# Altium schematic sheet S3_LED_MAT_FPGA_POWER.SchDoc: FPGA Power
size A3; Date: "Day, Month  DD, YYYY"; DrawnBy: KSN; Engineer: Dim Su; Revision: 2.0; SheetNumber: 4; SheetTotal: 7; ContentRev1: Original Document; dateREV1: "Aug/08/2018"; dateREV2: "Sep/03/2018"; ContentRev2: Changes to the power pins; Rev1: V1; Rev2: V2; Project: LED_MAT_3
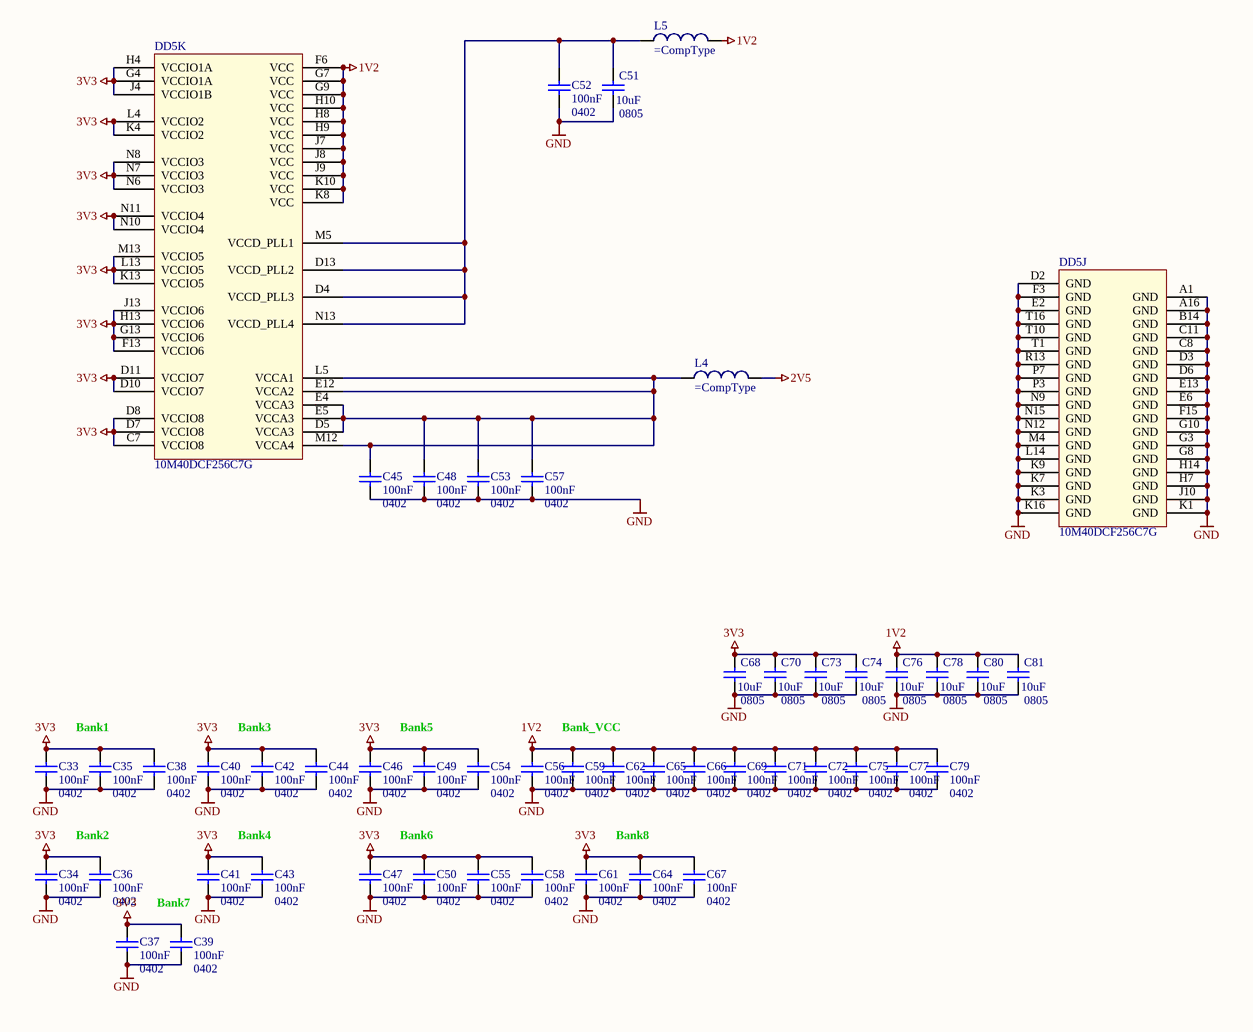
[diagram p0: S3_LED_MAT_FPGA_POWER.SchDoc]

## Parts
C33  value 100nF  Package: 0402  [CAPC1005L]  (hidden comment: 100nF / 0402 / X7R / 16V)
C34  value 100nF  Package: 0402  [CAPC1005L]  (hidden comment: 100nF / 0402 / X7R / 16V)
C35  value 100nF  Package: 0402  [CAPC1005L]  (hidden comment: 100nF / 0402 / X7R / 16V)
C36  value 100nF  Package: 0402  [CAPC1005L]  (hidden comment: 100nF / 0402 / X7R / 16V)
C37  value 100nF  Package: 0402  [CAPC1005L]  (hidden comment: 100nF / 0402 / X7R / 16V)
C38  value 100nF  Package: 0402  [CAPC1005L]  (hidden comment: 100nF / 0402 / X7R / 16V)
C39  value 100nF  Package: 0402  [CAPC1005L]  (hidden comment: 100nF / 0402 / X7R / 16V)
C40  value 100nF  Package: 0402  [CAPC1005L]  (hidden comment: 100nF / 0402 / X7R / 16V)
C41  value 100nF  Package: 0402  [CAPC1005L]  (hidden comment: 100nF / 0402 / X7R / 16V)
C42  value 100nF  Package: 0402  [CAPC1005L]  (hidden comment: 100nF / 0402 / X7R / 16V)
C43  value 100nF  Package: 0402  [CAPC1005L]  (hidden comment: 100nF / 0402 / X7R / 16V)
C44  value 100nF  Package: 0402  [CAPC1005L]  (hidden comment: 100nF / 0402 / X7R / 16V)
C45  value 100nF  Package: 0402  [CAPC1005L]  (hidden comment: 100nF / 0402 / X7R / 16V)
C46  value 100nF  Package: 0402  [CAPC1005L]  (hidden comment: 100nF / 0402 / X7R / 16V)
C47  value 100nF  Package: 0402  [CAPC1005L]  (hidden comment: 100nF / 0402 / X7R / 16V)
C48  value 100nF  Package: 0402  [CAPC1005L]  (hidden comment: 100nF / 0402 / X7R / 16V)
C49  value 100nF  Package: 0402  [CAPC1005L]  (hidden comment: 100nF / 0402 / X7R / 16V)
C50  value 100nF  Package: 0402  [CAPC1005L]  (hidden comment: 100nF / 0402 / X7R / 16V)
C51  value 10uF  Package: 0805  [CAPC2012L]  (hidden comment: 10uF / 0805 /  X5R / 10V)
C52  value 100nF  Package: 0402  [CAPC1005L]  (hidden comment: 100nF / 0402 / X7R / 16V)
C53  value 100nF  Package: 0402  [CAPC1005L]  (hidden comment: 100nF / 0402 / X7R / 16V)
C54  value 100nF  Package: 0402  [CAPC1005L]  (hidden comment: 100nF / 0402 / X7R / 16V)
C55  value 100nF  Package: 0402  [CAPC1005L]  (hidden comment: 100nF / 0402 / X7R / 16V)
C56  value 100nF  Package: 0402  [CAPC1005L]  (hidden comment: 100nF / 0402 / X7R / 16V)
C57  value 100nF  Package: 0402  [CAPC1005L]  (hidden comment: 100nF / 0402 / X7R / 16V)
C58  value 100nF  Package: 0402  [CAPC1005L]  (hidden comment: 100nF / 0402 / X7R / 16V)
C59  value 100nF  Package: 0402  [CAPC1005L]  (hidden comment: 100nF / 0402 / X7R / 16V)
C61  value 100nF  Package: 0402  [CAPC1005L]  (hidden comment: 100nF / 0402 / X7R / 16V)
C62  value 100nF  Package: 0402  [CAPC1005L]  (hidden comment: 100nF / 0402 / X7R / 16V)
C64  value 100nF  Package: 0402  [CAPC1005L]  (hidden comment: 100nF / 0402 / X7R / 16V)
C65  value 100nF  Package: 0402  [CAPC1005L]  (hidden comment: 100nF / 0402 / X7R / 16V)
C66  value 100nF  Package: 0402  [CAPC1005L]  (hidden comment: 100nF / 0402 / X7R / 16V)
C67  value 100nF  Package: 0402  [CAPC1005L]  (hidden comment: 100nF / 0402 / X7R / 16V)
C68  value 10uF  Package: 0805  [CAPC2012L]  (hidden comment: 10uF / 0805 /  X5R / 10V)
C69  value 100nF  Package: 0402  [CAPC1005L]  (hidden comment: 100nF / 0402 / X7R / 16V)
C70  value 10uF  Package: 0805  [CAPC2012L]  (hidden comment: 10uF / 0805 /  X5R / 10V)
C71  value 100nF  Package: 0402  [CAPC1005L]  (hidden comment: 100nF / 0402 / X7R / 16V)
C72  value 100nF  Package: 0402  [CAPC1005L]  (hidden comment: 100nF / 0402 / X7R / 16V)
C73  value 10uF  Package: 0805  [CAPC2012L]  (hidden comment: 10uF / 0805 /  X5R / 10V)
C74  value 10uF  Package: 0805  [CAPC2012L]  (hidden comment: 10uF / 0805 /  X5R / 10V)
C75  value 100nF  Package: 0402  [CAPC1005L]  (hidden comment: 100nF / 0402 / X7R / 16V)
C76  value 10uF  Package: 0805  [CAPC2012L]  (hidden comment: 10uF / 0805 /  X5R / 10V)
C77  value 100nF  Package: 0402  [CAPC1005L]  (hidden comment: 100nF / 0402 / X7R / 16V)
C78  value 10uF  Package: 0805  [CAPC2012L]  (hidden comment: 10uF / 0805 /  X5R / 10V)
C79  value 100nF  Package: 0402  [CAPC1005L]  (hidden comment: 100nF / 0402 / X7R / 16V)
C80  value 10uF  Package: 0805  [CAPC2012L]  (hidden comment: 10uF / 0805 /  X5R / 10V)
C81  value 10uF  Package: 0805  [CAPC2012L]  (hidden comment: 10uF / 0805 /  X5R / 10V)
DD5  10M40DCF256C7G  [BGA100P16X16-256]  (parts J,K of 11)
L4  (no value)  [INDC2012L]
L5  (no value)  [INDC2012L]

## Nets
1V2: C56.2 C59.2 C62.2 C65.2 C66.2 C69.2 C71.2 C72.2 C75.2 C76.2 C77.2 C78.2 C79.2 C80.2 C81.2 DD5.F6(VCC) DD5.G7(VCC) DD5.G9(VCC) DD5.H8(VCC) DD5.H9(VCC) DD5.H10(VCC) DD5.J7(VCC) DD5.J8(VCC) DD5.J9(VCC) DD5.K8(VCC) DD5.K10(VCC) L5.2
2V5: L4.2
3V3: C33.2 C34.2 C35.2 C36.2 C37.2 C38.2 C39.2 C40.2 C41.2 C42.2 C43.2 C44.2 C46.2 C47.2 C49.2 C50.2 C54.2 C55.2 C58.2 C61.2 C64.2 C67.2 C68.2 C70.2 C73.2 C74.2 DD5.C7(VCCIO8) DD5.D7(VCCIO8) DD5.D8(VCCIO8) DD5.D10(VCCIO7) DD5.D11(VCCIO7) DD5.F13(VCCIO6) DD5.G4(VCCIO1A) DD5.G13(VCCIO6) DD5.H4(VCCIO1A) DD5.H13(VCCIO6) DD5.J4(VCCIO1B) DD5.J13(VCCIO6) DD5.K4(VCCIO2) DD5.K13(VCCIO5) DD5.L4(VCCIO2) DD5.L13(VCCIO5) DD5.M13(VCCIO5) DD5.N6(VCCIO3) DD5.N7(VCCIO3) DD5.N8(VCCIO3) DD5.N10(VCCIO4) DD5.N11(VCCIO4)
GND: C33.1 C34.1 C35.1 C36.1 C37.1 C38.1 C39.1 C40.1 C41.1 C42.1 C43.1 C44.1 C45.1 C46.1 C47.1 C48.1 C49.1 C50.1 C51.1 C52.1 C53.1 C54.1 C55.1 C56.1 C57.1 C58.1 C59.1 C61.1 C62.1 C64.1 C65.1 C66.1 C67.1 C68.1 C69.1 C70.1 C71.1 C72.1 C73.1 C74.1 C75.1 C76.1 C77.1 C78.1 C79.1 C80.1 C81.1 DD5.A1(GND) DD5.A16(GND) DD5.B14(GND) DD5.C8(GND) DD5.C11(GND) DD5.D2(GND) DD5.D3(GND) DD5.D6(GND) DD5.E2(GND) DD5.E6(GND) DD5.E13(GND) DD5.F3(GND) DD5.F15(GND) DD5.G3(GND) DD5.G8(GND) DD5.G10(GND) DD5.H7(GND) DD5.H14(GND) DD5.J10(GND) DD5.K1(GND) DD5.K3(GND) DD5.K7(GND) DD5.K9(GND) DD5.K16(GND) DD5.L14(GND) DD5.M4(GND) DD5.N9(GND) DD5.N12(GND) DD5.N15(GND) DD5.P3(GND) DD5.P7(GND) DD5.R13(GND) DD5.T1(GND) DD5.T10(GND) DD5.T16(GND)
NetC45_2: C45.2 C48.2 C53.2 C57.2 DD5.D5(VCCA3) DD5.E4(VCCA3) DD5.E5(VCCA3) DD5.E12(VCCA2) DD5.L5(VCCA1) DD5.M12(VCCA4) L4.1
NetC51_2: C51.2 C52.2 DD5.D4(VCCD_PLL3) DD5.D13(VCCD_PLL2) DD5.M5(VCCD_PLL1) DD5.N13(VCCD_PLL4) L5.1

## Notes on the sheet
- Bank1
- Bank3
- Bank5
- Bank_VCC
- Bank2
- Bank4
- Bank6
- Bank8
- Bank7
- Title
- Size:
- Date:
- A3
- Number:
- Time:
- Revision:
- Sheet
- of
- File:

## Library data of the parts
C33-C50 C52-C59 C61 C62 C64-C67 C69 C71 C72 C75 C77 C79 = 100nF / 0402 / X7R / 16V: Capacitor ceramic; Manufacturer: SAMSUNG; Manufacturer Part Number: CL05B104KO5NNNC; Voltage: 16V; CompName: Capacitor; Price: 0.2
C51 C68 C70 C73 C74 C76 C78 C80 C81 = 10uF / 0805 /  X5R / 10V: Capacitor ceramic; Voltage: 10V; CompName: Capacitor; Price: 0.2
DD5 = 10M40DCF256C7G: FPGA; CompName: IC; Manufacturer: ALTERA; Manufacturer Part Number: 10M40DCF256C7GA; CompKind: 0; CompType: 10M40DCF256C7G; ValueBOM: 10M40DCF256C7G; Package: BGA256; Price: 1800; Remarks: *; Supplier: ARROW
L4 L5 = INDUCTOR: Ferrite bead; Manufacturer: Murata; Manufacturer Part Number: BLM21PG221SN1; CompName: Inductor; Package: 0805; Price: 0.06